# Altium schematic sheet MA-Portenta.SchDoc
size A4; SheetNumber: 5; SheetTotal: 7
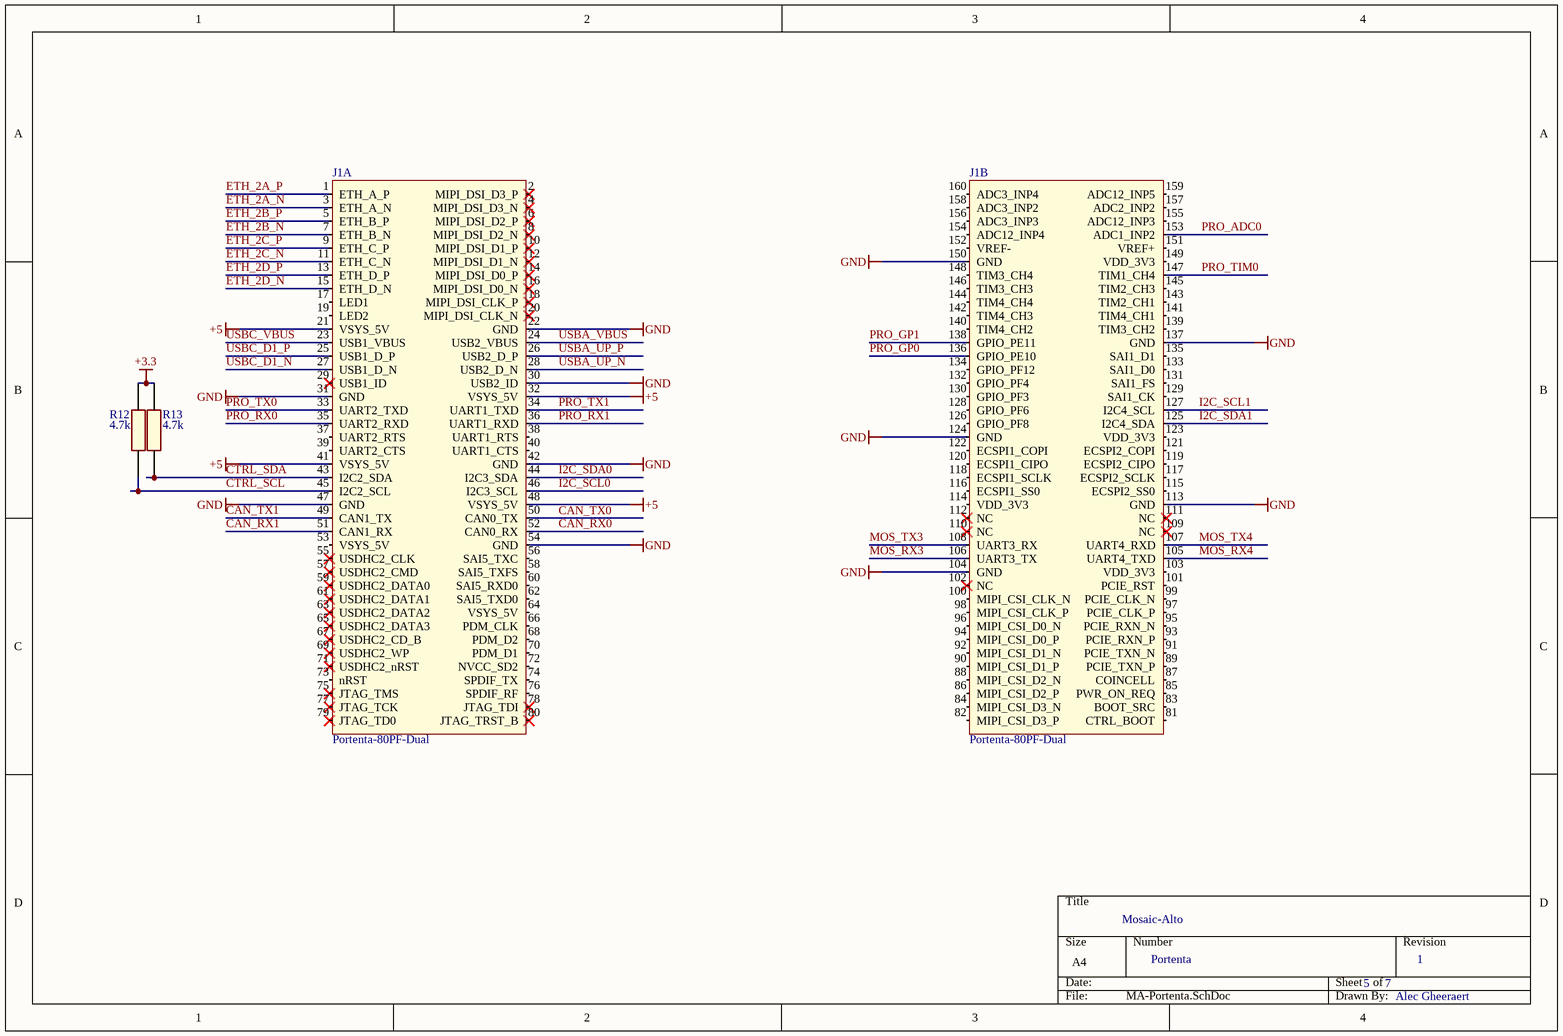
[diagram p0: MA-Portenta.SchDoc]

## Parts
J1  Portenta-80PF-Dual  [HRS_DF40C-80DP-0.4V(51)]  (parts A,B of 2)
R12  4.7k  [RESC1005X40N]
R13  4.7k  [RESC1005X40N]

## Nets
+3.3: R12.2 R13.1
+5: J1.21(VSYS_5V) J1.32(VSYS_5V) J1.41(VSYS_5V) J1.48(VSYS_5V)
GND: J1.22(GND) J1.30(USB2_ID) J1.31(GND) J1.42(GND) J1.47(GND) J1.54(GND) J1.104(GND) J1.113(GND) J1.124(GND) J1.137(GND) J1.150(GND)
CAN_RX0: J1.52(CAN0_RX)
CAN_RX1: J1.51(CAN1_RX)
CAN_TX0: J1.50(CAN0_TX)
CAN_TX1: J1.49(CAN1_TX)
CTRL_SCL: J1.45(I2C2_SCL) R12.1
CTRL_SDA: J1.43(I2C2_SDA) R13.2
ETH_2A_N: J1.3(ETH_A_N)
ETH_2A_P: J1.1(ETH_A_P)
ETH_2B_N: J1.7(ETH_B_N)
ETH_2B_P: J1.5(ETH_B_P)
ETH_2C_N: J1.11(ETH_C_N)
ETH_2C_P: J1.9(ETH_C_P)
ETH_2D_N: J1.15(ETH_D_N)
ETH_2D_P: J1.13(ETH_D_P)
I2C_SCL0: J1.46(I2C3_SCL)
I2C_SCL1: J1.127(I2C4_SCL)
I2C_SDA0: J1.44(I2C3_SDA)
I2C_SDA1: J1.125(I2C4_SDA)
MOS_RX3: J1.106(UART3_TX)
MOS_RX4: J1.105(UART4_TXD)
MOS_TX3: J1.108(UART3_RX)
MOS_TX4: J1.107(UART4_RXD)
PRO_ADC0: J1.153(ADC1_INP2)
PRO_GP0: J1.136(GPIO_PE10)
PRO_GP1: J1.138(GPIO_PE11)
PRO_RX0: J1.35(UART2_RXD)
PRO_RX1: J1.36(UART1_RXD)
PRO_TIM0: J1.147(TIM1_CH4)
PRO_TX0: J1.33(UART2_TXD)
PRO_TX1: J1.34(UART1_TXD)
USBA_UP_N: J1.28(USB2_D_N)
USBA_UP_P: J1.26(USB2_D_P)
USBA_VBUS: J1.24(USB2_VBUS)
USBC_D1_N: J1.27(USB1_D_N)
USBC_D1_P: J1.25(USB1_D_P)
USBC_VBUS: J1.23(USB1_VBUS)

Not connected (* = marked no-connect by the designer): J1 2(MIPI_DSI_D3_P)* 4(MIPI_DSI_D3_N)* 6(MIPI_DSI_D2_P)* 8(MIPI_DSI_D2_N)* 10(MIPI_DSI_D1_P)* 12(MIPI_DSI_D1_N)* 14(MIPI_DSI_D0_P)* 16(MIPI_DSI_D0_N)* 17(LED1) 18(MIPI_DSI_CLK_P)* 19(LED2) 20(MIPI_DSI_CLK_N)* 29(USB1_ID)* 37(UART2_RTS) 38(UART1_RTS) 39(UART2_CTS) 40(UART1_CTS) 53(VSYS_5V) 55(USDHC2_CLK)* 56(SAI5_TXC) 57(USDHC2_CMD)* 58(SAI5_TXFS) 59(USDHC2_DATA0)* 60(SAI5_RXD0) 61(USDHC2_DATA1)* 62(SAI5_TXD0) 63(USDHC2_DATA2)* 64(VSYS_5V) 65(USDHC2_DATA3)* 66(PDM_CLK) 67(USDHC2_CD_B)* 68(PDM_D2) 69(USDHC2_WP)* 70(PDM_D1) 71(USDHC2_nRST)* 72(NVCC_SD2) 73(nRST) 74(SPDIF_TX) 75(JTAG_TMS)* 76(SPDIF_RF) 77(JTAG_TCK)* 78(JTAG_TDI)* 79(JTAG_TD0)* 80(JTAG_TRST_B)* 81(CTRL_BOOT) 82(MIPI_CSI_D3_P) 83(BOOT_SRC) 84(MIPI_CSI_D3_N) 85(PWR_ON_REQ) 86(MIPI_CSI_D2_P) 87(COINCELL) 88(MIPI_CSI_D2_N) 89(PCIE_TXN_P) 90(MIPI_CSI_D1_P) 91(PCIE_TXN_N) 92(MIPI_CSI_D1_N) 93(PCIE_RXN_P) 94(MIPI_CSI_D0_P) 95(PCIE_RXN_N) 96(MIPI_CSI_D0_N) 97(PCIE_CLK_P) 98(MIPI_CSI_CLK_P) 99(PCIE_CLK_N) 100(MIPI_CSI_CLK_N) 101(PCIE_RST) 102(NC)* 103(VDD_3V3) 109(NC)* 110(NC)* 111(NC)* 112(NC)* 114(VDD_3V3) 115(ECSPI2_SS0) 116(ECSPI1_SS0) 117(ECSPI2_SCLK) 118(ECSPI1_SCLK) 119(ECSPI2_CIPO) 120(ECSPI1_CIPO) 121(ECSPI2_COPI) 122(ECSPI1_COPI) 123(VDD_3V3) 126(GPIO_PF8) 128(GPIO_PF6) 129(SAI1_CK) 130(GPIO_PF3) 131(SAI1_FS) 132(GPIO_PF4) 133(SAI1_D0) 134(GPIO_PF12) 135(SAI1_D1) 139(TIM3_CH2) 140(TIM4_CH2) 141(TIM4_CH1) 142(TIM4_CH3) 143(TIM2_CH1) 144(TIM4_CH4) 145(TIM2_CH3) 146(TIM3_CH3) 148(TIM3_CH4) 149(VDD_3V3) 151(VREF+) 152(VREF-) 154(ADC12_INP4) 155(ADC12_INP3) 156(ADC3_INP3) 157(ADC2_INP2) 158(ADC3_INP2) 159(ADC12_INP5) 160(ADC3_INP4)

## Notes on the sheet
- Mosaic-Alto
- Portenta
- 5
- 7
- 1
- Alec Gheeraert

## Library data of the parts
J1 = CMP-00090-3: 80 Pin Arduino Pro Female; Mounting Angle: Vertical; Pins: 160; Mounting Style: SMD; Manufacturer: Arduino
R12 R13 = CMP-00030-4: 0402I 4.7k; Manufacturer: Walsin; Power Rating: 62.5mW; Qualification: AEC-Q200; Voltage Rating: 50V; Tolerance: 1%; Max Operating Temperature: 155; Package: 0402; Min Operating Temperature: -55; Resistance: 4.7k